# EAGLE design PGTN013_halo_fuzz (EAGLE 8.5.2)
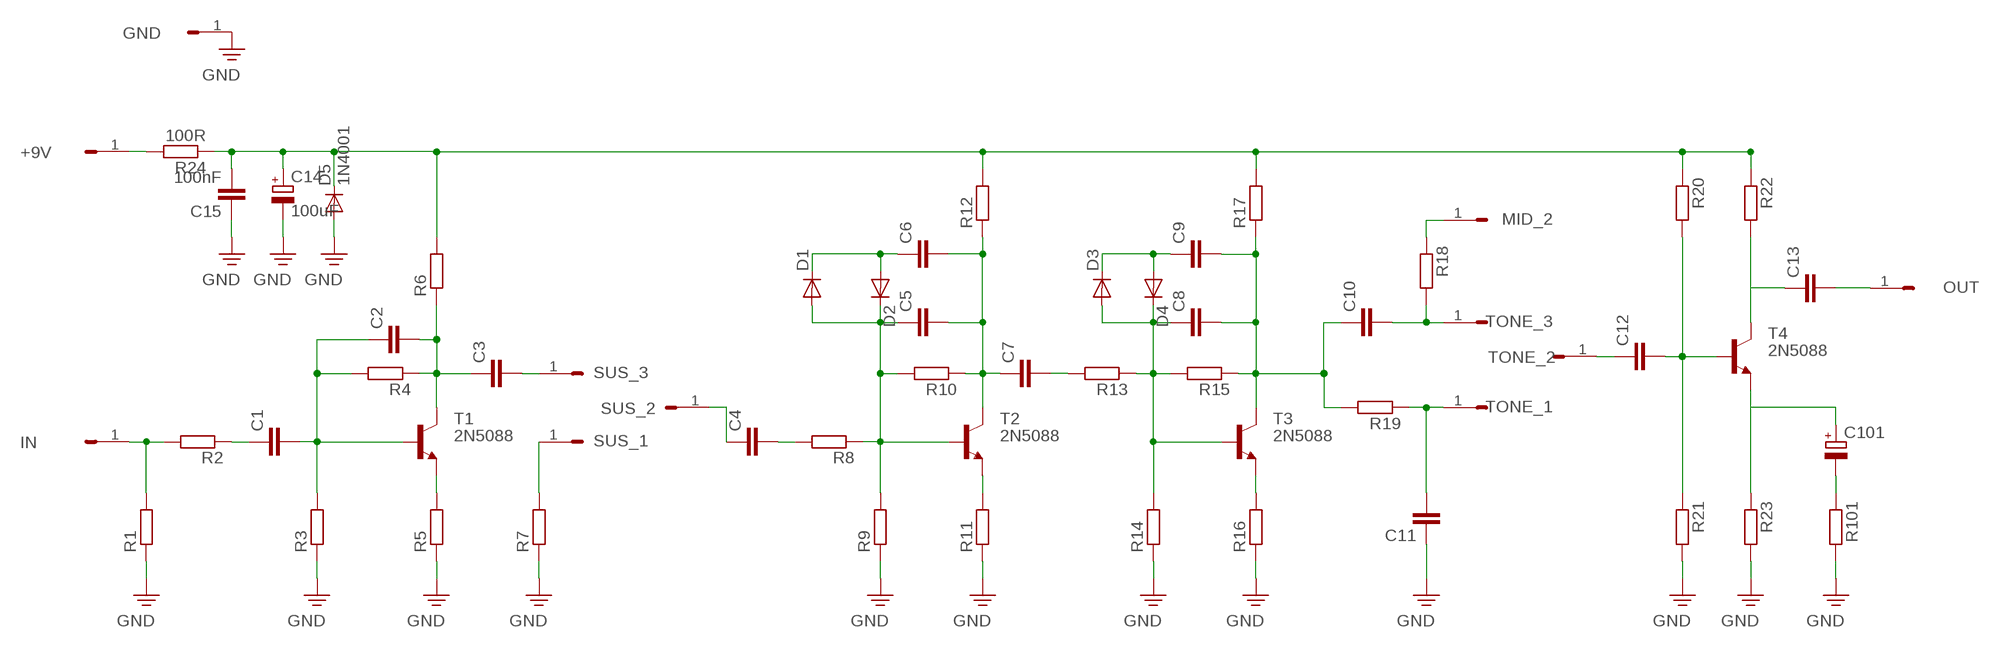
[diagram p0: schematic, sheet 1]

## Parts
+9V  HEADER/MALE/01  [HEADER/MALE/01]
C1  CAPACITORCERAMICDISC/5  [CERAMICDISC/5]
C2  CAPACITORCERAMICDISC/5  [CERAMICDISC/5]
C3  CAPACITORCERAMICDISC/5  [CERAMICDISC/5]
C4  CAPACITORCERAMICDISC/5  [CERAMICDISC/5]
C5  CAPACITORCERAMICDISC/5  [CERAMICDISC/5]
C6  CAPACITORCERAMICDISC/5  [CERAMICDISC/5]
C7  CAPACITORCERAMICDISC/5  [CERAMICDISC/5]
C8  CAPACITORCERAMICDISC/5  [CERAMICDISC/5]
C9  CAPACITORCERAMICDISC/5  [CERAMICDISC/5]
C10  CAPACITORCERAMICDISC/5  [CERAMICDISC/5]
C11  CAPACITORCERAMICDISC/5  [CERAMICDISC/5]
C12  CAPACITORCERAMICDISC/5  [CERAMICDISC/5]
C13  CAPACITORCERAMICDISC/5  [CERAMICDISC/5]
C14  100uF  CAPACITOR/POLARIZEDE3.5-8  [E3,5-8]
C15  100nF  CAPACITORCERAMICDISC/5  [CERAMICDISC/5]
C101  CAPACITOR/POLARIZEDE3.5-8  [E3,5-8]
D1  1N4148DO35-7  [DO35-7]
D2  1N4148DO35-7  [DO35-7]
D3  1N4148DO35-7  [DO35-7]
D4  1N4148DO35-7  [DO35-7]
D5  1N4001  1N4148DO35-7  [DO35-7]
GND  HEADER/MALE/01  [HEADER/MALE/01]
IN  HEADER/MALE/01  [HEADER/MALE/01]
MID_2  HEADER/MALE/01  [HEADER/MALE/01]
OUT  HEADER/MALE/01  [HEADER/MALE/01]
R1  RESISTORRESISTOR/UPRIGHT/7.5  [RESISTOR/7.5]
R2  RESISTORRESISTOR/UPRIGHT/7.5  [RESISTOR/7.5]
R3  RESISTORRESISTOR/UPRIGHT/7.5  [RESISTOR/7.5]
R4  RESISTORRESISTOR/UPRIGHT/7.5  [RESISTOR/7.5]
R5  RESISTORRESISTOR/UPRIGHT/7.5  [RESISTOR/7.5]
R6  RESISTORRESISTOR/UPRIGHT/7.5  [RESISTOR/7.5]
R7  RESISTORRESISTOR/UPRIGHT/7.5  [RESISTOR/7.5]
R8  RESISTORRESISTOR/UPRIGHT/7.5  [RESISTOR/7.5]
R9  RESISTORRESISTOR/UPRIGHT/7.5  [RESISTOR/7.5]
R10  RESISTORRESISTOR/UPRIGHT/7.5  [RESISTOR/7.5]
R11  RESISTORRESISTOR/UPRIGHT/7.5  [RESISTOR/7.5]
R12  RESISTORRESISTOR/UPRIGHT/7.5  [RESISTOR/7.5]
R13  RESISTORRESISTOR/UPRIGHT/7.5  [RESISTOR/7.5]
R14  RESISTORRESISTOR/UPRIGHT/7.5  [RESISTOR/7.5]
R15  RESISTORRESISTOR/UPRIGHT/7.5  [RESISTOR/7.5]
R16  RESISTORRESISTOR/UPRIGHT/7.5  [RESISTOR/7.5]
R17  RESISTORRESISTOR/UPRIGHT/7.5  [RESISTOR/7.5]
R18  RESISTORRESISTOR/UPRIGHT/7.5  [RESISTOR/7.5]
R19  RESISTORRESISTOR/UPRIGHT/7.5  [RESISTOR/7.5]
R20  RESISTORRESISTOR/UPRIGHT/7.5  [RESISTOR/7.5]
R21  RESISTORRESISTOR/UPRIGHT/7.5  [RESISTOR/7.5]
R22  RESISTORRESISTOR/UPRIGHT/7.5  [RESISTOR/7.5]
R23  RESISTORRESISTOR/UPRIGHT/7.5  [RESISTOR/7.5]
R24  100R  RESISTORRESISTOR/UPRIGHT/7.5  [RESISTOR/7.5]
R101  RESISTORRESISTOR/UPRIGHT/7.5  [RESISTOR/7.5]
SUS_1  HEADER/MALE/01  [HEADER/MALE/01]
SUS_2  HEADER/MALE/01  [HEADER/MALE/01]
SUS_3  HEADER/MALE/01  [HEADER/MALE/01]
T1  2N5088  [TO92]
T2  2N5088  [TO92]
T3  2N5088  [TO92]
T4  2N5088  [TO92]
TONE_1  HEADER/MALE/01  [HEADER/MALE/01]
TONE_2  HEADER/MALE/01  [HEADER/MALE/01]
TONE_3  HEADER/MALE/01  [HEADER/MALE/01]

## Nets
N$1: IN.1 R1.2 R2.2
N$2: C1.1 R2.1
N$3: C1.2 C2.1 R3.2 R4.2 T1.2(B)
N$4: C2.2 C3.1 R4.1 R6.1 T1.1(C)
N$5: R5.2 T1.3(E)
N$6: C3.2 SUS_3.1
N$7: C14.+ C15.2 D5.C R6.2 R12.2 R17.2 R20.1 R22.1 R24.1
N$8: R7.2 SUS_1.1
N$9: C4.1 SUS_2.1
N$10: C4.2 R8.2
N$11: C5.1 D1.A D2.C R8.1 R9.2 R10.2 T2.2(B)
N$12: C5.2 C6.2 C7.1 R10.1 R12.1 T2.1(C)
N$13: R11.2 T2.3(E)
N$14: C6.1 D1.C D2.A
N$15: C7.2 R13.2
N$16: C8.1 D3.A D4.C R13.1 R14.2 R15.2 T3.2(B)
N$17: C10.2 R18.2 TONE_3.1
N$18: R16.2 T3.3(E)
N$19: C9.1 D3.C D4.A
N$20: C8.2 C9.2 C10.1 R15.1 R17.1 R19.2 T3.1(C)
N$21: C11.2 R19.1 TONE_1.1
N$22: MID_2.1 R18.1
N$23: C12.1 TONE_2.1
N$24: C12.2 R20.2 R21.1 T4.2(B)
N$25: C13.1 R22.2 T4.1(C)
N$26: C101.+ R23.1 T4.3(E)
N$27: C13.2 OUT.1
N$28: C101.- R101.1
N$29: +9V.1 R24.2
PE: C11.1 C14.- C15.1 D5.A GND.1 R1.1 R3.1 R5.1 R7.1 R9.1 R11.1 R14.1 R16.1 R21.2 R23.2 R101.2 ; supply symbol labelled GND

## Library data of the parts
+9V GND IN MID_2 OUT SUS_1-SUS_3 TONE_1-TONE_3 = connectors:HEADER/MALE/01
C1-C13 C15 = capacitors:CAPACITOR: CAPACITOR, European symbol
C14 C101 = capacitors:CAPACITOR/POLARIZED: POLARIZED CAPACITOR, European symbol
D1-D5 = transistors:1N4148: DIODE high speed (Philips)
R1-R24 R101 = resistors:RESISTOR: RESISTOR, European symbol
T1-T4 = transistor:2N5088: NPN TRANSISTOR

## Board
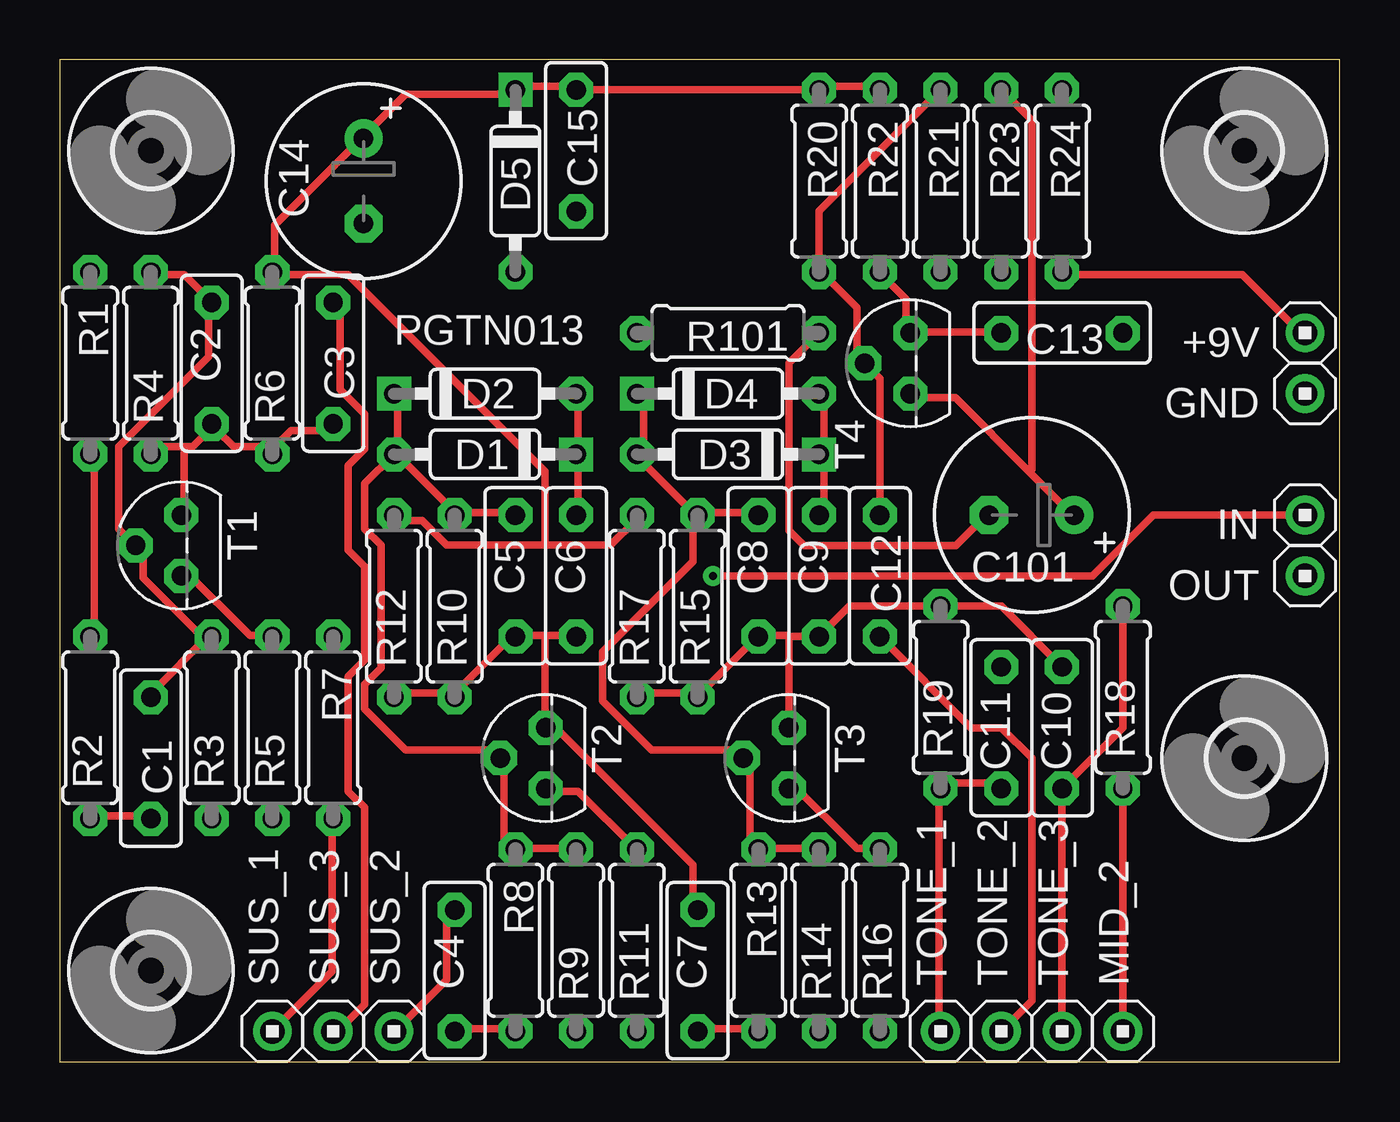
[diagram p1: board, top side]
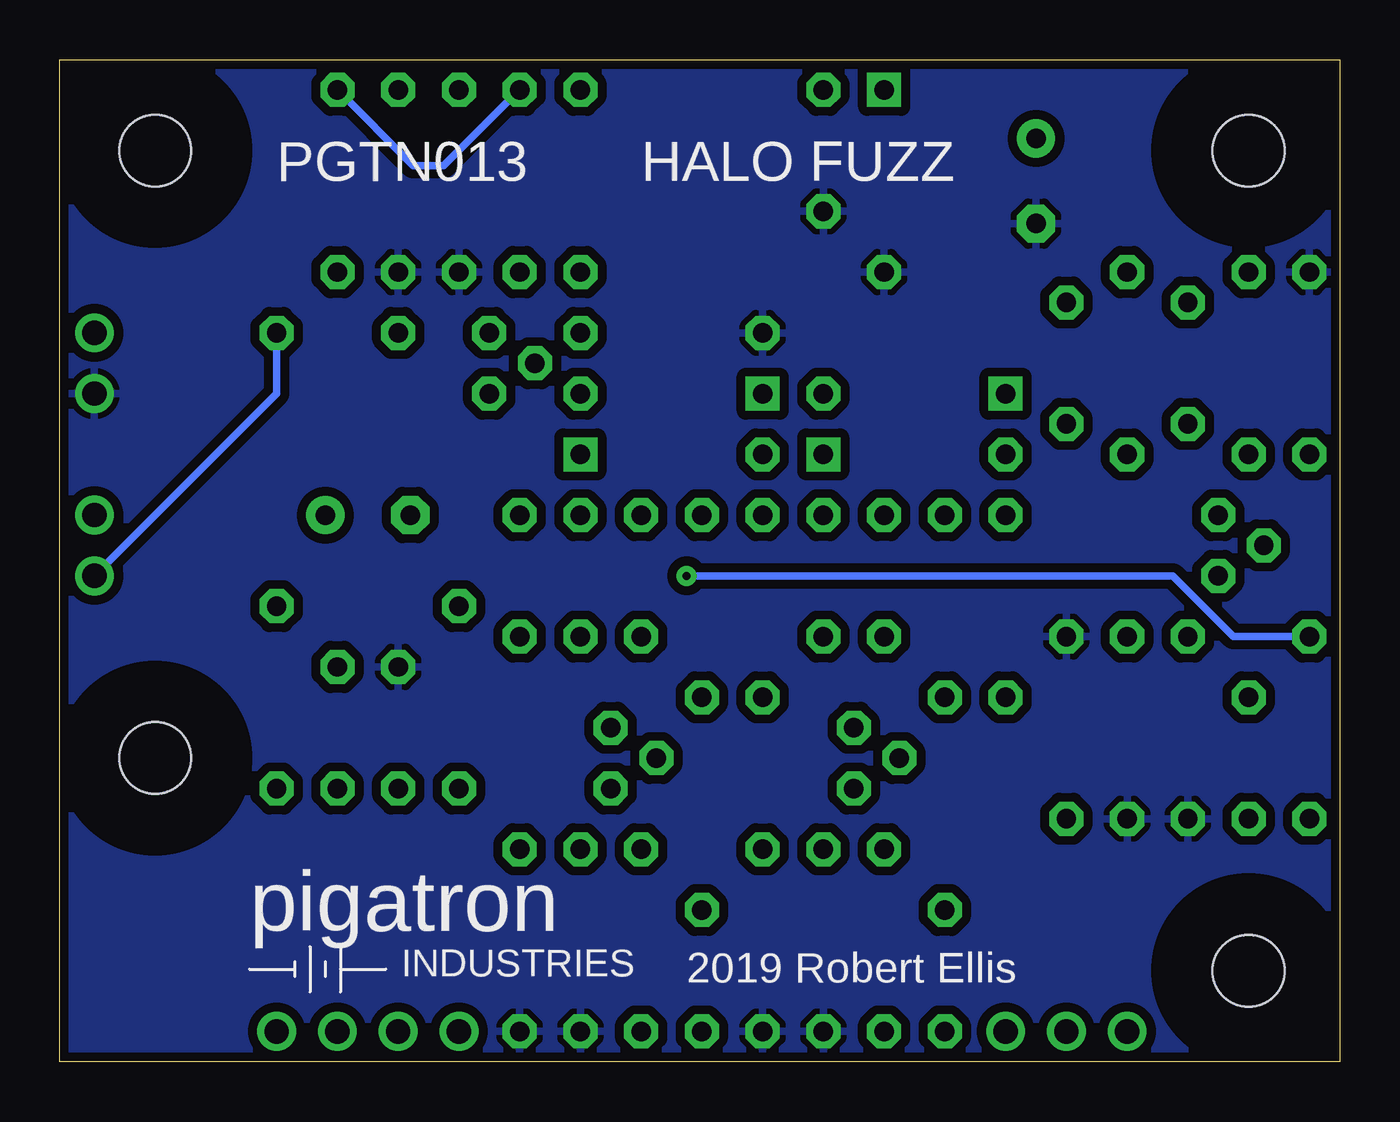
[diagram p2: board, bottom side, seen from below]

Size 53.52 x 41.9 mm. Coordinates in mm from the lower left corner, seen from the top.
Outline: 0,0 53.52,0 53.52,41.9 0,41.9 0,0
Copper layers (1*16): Top 0.0356mm / dielectric 1.5011mm / Bottom 0.0356mm
Design rules "rob": minimum track width 12mil, minimum drill 13mil, track to track 15mil, track to pad 10mil, pad to pad 10mil, via to via 10mil, smd to smd 6mil, copper to edge 15mil, drill to drill 10mil, minimum pad ring 12mil, minimum via ring 10mil, stop-mask expansion 4mil, vias tented up to drill 0mil, thermal gap 10mil

### Footprints (pad centres in the part's own frame; a part is rotated, then mirrored left to right if it is on the bottom)
HEADER/MALE/01 = drill 1.016: 1 0,0
CERAMICDISC/5 = drill 0.813 octagon: 1 -2.54,0; 2 2.54,0
E3,5-8 = drill 0.813 pad 1.6: + -1.778,0 | drill 0.813 pad 1.6 octagon: - 1.778,0
DO35-7 = drill 0.813 octagon: A 3.81,0 | drill 0.813 square: C -3.81,0
RESISTOR/7.5 = drill 0.813 octagon: 1 -3.81,0; 2 3.81,0
TO92 = drill 0.813 octagon: 1 1.27,0; 2 0,1.905; 3 -1.27,0
STANDOFF/3.0 = hole 3: 0,0

### Placement (x,y rotation side)
+9V  52.07,30.48 180 top
C1  3.81,12.7 90 top
C2  6.35,29.21 270 top
C3  11.43,29.21 90 top
C4  16.51,3.81 270 top
C5  19.05,20.32 270 top
C6  21.59,20.32 270 top
C7  26.67,3.81 270 top
C8  29.21,20.32 270 top
C9  31.75,20.32 270 top
C10  41.91,13.97 270 top
C11  39.37,13.97 270 top
C12  34.29,20.32 90 top
C13  41.91,30.48 0 top
C14  12.7,36.83 270 top
C15  21.59,38.1 90 top
C101  40.64,22.86 180 top
D1  17.78,25.4 180 top
D2  17.78,27.94 0 top
D3  27.94,25.4 180 top
D4  27.94,27.94 0 top
D5  19.05,36.83 270 top
GND  52.07,27.94 180 top
IN  52.07,22.86 180 top
MID_2  44.45,1.27 90 top
OUT  52.07,20.32 180 top
R1  1.27,29.21 270 top
R2  1.27,13.97 90 top
R3  6.35,13.97 90 top
R4  3.81,29.21 90 top
R5  8.89,13.97 90 top
R6  8.89,29.21 90 top
R7  11.43,13.97 270 top
R8  19.05,5.08 270 top
R9  21.59,5.08 90 top
R10  16.51,19.05 90 top
R11  24.13,5.08 90 top
R12  13.97,19.05 90 top
R13  29.21,5.08 270 top
R14  31.75,5.08 90 top
R15  26.67,19.05 90 top
R16  34.29,5.08 90 top
R17  24.13,19.05 90 top
R18  44.45,15.24 90 top
R19  36.83,15.24 90 top
R20  31.75,36.83 270 top
R21  36.83,36.83 270 top
R22  34.29,36.83 270 top
R23  39.37,36.83 270 top
R24  41.91,36.83 270 top
R101  27.94,30.48 180 top
SUS_1  8.89,1.27 90 top
SUS_2  13.97,1.27 90 top
SUS_3  11.43,1.27 90 top
T1  5.08,21.59 90 top
T2  20.32,12.7 90 top
T3  30.48,12.7 90 top
T4  35.56,29.21 90 top
TONE_1  36.83,1.27 90 top
TONE_2  39.37,1.27 90 top
TONE_3  41.91,1.27 90 top
U$1  [STANDOFF/3.0]  3.81,3.81 0 top
U$2  [STANDOFF/3.0]  49.53,12.7 0 top
U$3  [STANDOFF/3.0]  3.81,38.1 0 top
U$4  [STANDOFF/3.0]  49.53,38.1 0 top
U$5  [PIGATRON-LOGO]  36.7,5.46 0 bottom

### Tracks (layer width: path | path; a pad name or v marks a point on that pad's centre or on a via)
N$1  (via drill 0.33)
  Top 0.305: R2.2 1.43,17.83 1.43,25.38 R1.2 | IN.1 45.72,22.86 43.18,20.32 v27.3,20.32
  Bottom 0.305: v27.3,20.32 6.98,20.32 4.45,17.78 R2.2
N$2
  Top 0.305: R2.1 1.43,10.29 3.49,10.29 C1.1
N$3
  Top 0.305: R4.2 3.83,32.92 5.21,32.92 6.24,31.89 C2.1 6.24,31.55 6.24,29.49 2.46,25.72 2.46,22.29 3.15,21.6 T1.2 3.49,21.26 3.49,20.23 6.24,17.49 R3.2 6.24,17.83 3.83,15.43 C1.2
N$4
  Top 0.305: 5.21,25.72 5.55,25.72 6.24,26.4 C2.2 6.58,26.4 7.26,25.72 8.64,25.72 R6.1 8.98,25.72 9.66,26.4 11.38,26.4 C3.1 | 5.21,25.72 3.83,25.72 R4.1 | 5.21,25.72 5.21,22.97 T1.1
N$5
  Top 0.305: R5.2 8.64,17.83 7.95,17.83 5.21,20.57 T1.3
N$6
  Top 0.305: C3.2 11.72,31.55 11.72,28.12 12.75,27.09 12.75,25.62 12.06,24.93 12.06,21.4 12.75,20.71 12.75,16.8 12.06,16.12 12.06,11.32 12.75,10.63 12.75,2.4 11.72,1.37 SUS_3.1
N$7
  Top 0.305: 20.3,21.6 23.04,21.6 24.07,22.63 R17.2 | 20.3,21.6 16.18,21.6 15.15,22.63 14.12,22.63 R12.2 | 20.3,21.6 20.3,24.69 12.06,32.92 8.98,32.92 R6.2 8.98,33.26 8.98,34.98 12.41,38.41 C14.+ 12.75,38.75 14.47,40.46 18.92,40.46 D5.C 19.27,40.8 21.32,40.8 C15.2 R20.1 31.95,40.8 34.01,40.8 R22.1
  Bottom 0.305: R24.1 38.73,37.47 37.47,37.47 R22.1
N$8
  Top 0.305: R7.2 11.38,9.94 11.38,3.77 8.98,1.37 SUS_1.1
N$9
  Top 0.305: C4.1 16.18,6.17 16.18,3.43 14.12,1.37 SUS_2.1
N$10
  Top 0.305: C4.2 16.52,1.37 18.92,1.37 R8.2
N$11
  Top 0.305: R9.2 21.32,8.91 19.27,8.91 R8.1 18.92,8.91 18.58,9.26 18.58,12.69 T2.2 18.24,13.03 14.47,13.03 12.75,14.74 12.75,15.77 13.44,16.46 13.44,21.6 12.75,22.29 12.75,22.86 12.75,23.32 12.75,24.18 D1.A | D1.A 14.12,25.72 14.12,27.77 D2.C | 16.52,22.97 18.92,22.97 C5.1 | 16.52,22.97 14.47,25.03 | 14.47,25.03 14.12,25.38 D1.A | 16.52,22.97 R10.2 | 14.47,25.03 D1.A
N$12
  Top 0.305: R12.1 14.12,15.43 16.18,15.43 R10.1 16.52,15.43 18.92,17.83 C5.2 19.27,17.83 20.3,17.83 | 20.3,17.83 21.32,17.83 C6.2 | C7.1 26.47,6.51 26.47,8.23 20.64,14.06 T2.1 20.3,14.06 20.3,17.83
N$13
  Top 0.305: T2.3 20.64,11.32 21.67,11.32 24.07,8.91 R11.2
N$14
  Top 0.305: C6.1 21.67,22.97 21.67,25.38 D1.C 21.67,25.72 21.67,27.77 D2.A
N$15
  Top 0.305: C7.2 26.81,1.37 29.21,1.37 R13.2
N$16
  Top 0.305: 29.21,8.91 31.61,8.91 R14.2 | 29.21,8.91 28.87,9.26 28.87,12.69 T3.2 28.52,13.03 24.75,13.03 22.7,15.09 22.7,17.14 26.47,20.92 26.47,22.63 R15.2 | 29.21,8.91 R13.1 | R15.2 26.81,22.97 29.21,22.97 C8.1 | D4.C 24.41,27.77 24.41,25.72 D3.A 24.07,25.38 26.47,22.97 R15.2
N$17
  Top 0.305: TONE_3.1 41.9,1.37 41.9,11.32 C10.2 44.45,13.97 R18.2
N$18
  Top 0.305: R16.2 34.01,8.91 33.33,8.91 30.58,11.66 T3.3
N$19
  Top 0.305: C9.1 31.95,22.97 31.95,25.38 D3.C 31.95,25.72 31.95,27.77 D4.A
N$20
  Top 0.305: R17.1 24.41,15.43 26.47,15.43 R15.1 26.81,15.43 29.21,17.83 | 29.21,17.83 C8.2 | T3.1 30.48,17.78 | 30.48,17.78 30.43,17.83 29.21,17.83 | 30.48,17.78 C9.2 33.02,19.05 R19.2 39.37,19.05 C10.1
N$21
  Top 0.305: C11.2 39.15,11.66 37.1,11.66 R19.1 36.75,11.32 36.75,1.37 TONE_1.1
N$22
  Top 0.305: R18.1 MID_2.1
N$23
  Top 0.305: C12.1 38.1,13.97 39.37,13.97 40.64,12.7 40.64,2.54 TONE_2.1
N$24
  Top 0.305: R20.2 31.95,32.92 33.33,31.55 33.33,29.49 T4.2 34.29,28.57 C12.2 | 31.95,33.26 R20.2 | R20.2 31.75,35.56 R21.1
N$25
  Top 0.305: R22.2 34.35,32.92 35.38,31.89 35.38,30.52 T4.1 35.73,30.52 39.15,30.52 C13.1
N$26
  Top 0.305: 40.55,24.67 42.24,22.97 C101.+ | 40.55,24.67 37.44,27.77 35.73,27.77 T4.3 | 40.55,24.67 40.64,24.77 40.64,39.37 R23.1
N$27
  Bottom 0.305: OUT.1 44.45,27.94 C13.2
N$28
  Top 0.305: R101.1 30.48,29.21 30.48,22.23 31.12,21.59 37.47,21.59 38.73,22.86 C101.-
N$29
  Top 0.305: R24.2 42.24,32.92 49.44,32.92 51.84,30.52 +9V.1
PE
  pour Bottom: 0,41.91 53.34,41.91 53.34,0 0,0

### Text on the board
tNames: PGTN013
bNames: HALO FUZZ | PGTN013 | 2019 Robert Ellis